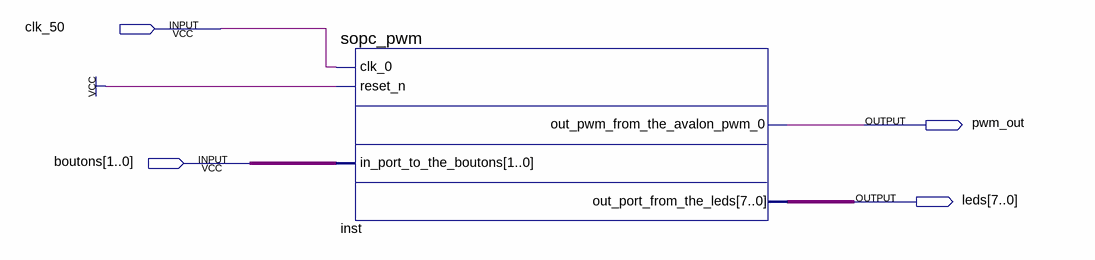
[diagram p0: schematic sheet]
// Quartus schematic sopc_pwm_avalon.bdf as structural Verilog: 1 symbols, 4 pins
module sopc_pwm_avalon (
  input  clk_50,
  input  [1:0] boutons,
  output pwm_out,
  output [7:0] leds
);

  sopc_pwm inst (
    .clk_0(clk_50), .reset_n(1'b1), .in_port_to_the_boutons(boutons),
    .out_pwm_from_the_avalon_pwm_0(pwm_out), .out_port_from_the_leds(leds));
endmodule
